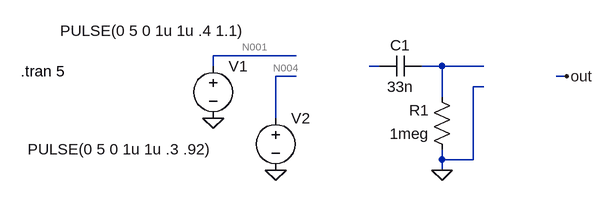
[diagram p0: schematic PseudoRandomPeriod.asc]
PseudoRandomPeriod.asc, the LTspice schematic file:
Version 4
SHEET 1 880 680
WIRE 160 144 32 144
WIRE 32 160 32 144
WIRE 288 160 272 160
WIRE 384 160 352 160
WIRE 448 160 384 160
WIRE 160 176 128 176
WIRE 576 176 560 176
WIRE 448 192 432 192
WIRE 384 208 384 160
WIRE 128 240 128 176
WIRE 384 304 384 288
WIRE 432 304 432 192
WIRE 432 304 384 304
WIRE 384 320 384 304
FLAG 32 240 0
FLAG 128 320 0
FLAG 384 320 0
FLAG 576 176 out
SYMBOL voltage 32 144 R0
WINDOW 3 -235 -38 Left 2
WINDOW 123 0 0 Left 2
WINDOW 39 0 0 Left 2
SYMATTR Value PULSE(0 5 0 1u 1u .4 1.1)
SYMATTR InstName V1
SYMBOL voltage 128 224 R0
WINDOW 3 -381 64 Left 2
WINDOW 123 0 0 Left 2
WINDOW 39 0 0 Left 2
SYMATTR Value PULSE(0 5 0 1u 1u .3 .92)
SYMATTR InstName V2
SYMBOL cap 352 144 R90
WINDOW 0 0 32 VBottom 2
WINDOW 3 32 32 VTop 2
SYMATTR InstName C1
SYMATTR Value 33n
SYMBOL res 400 304 R180
WINDOW 0 36 76 Left 2
WINDOW 3 36 40 Left 2
SYMATTR InstName R1
SYMATTR Value 1meg
TEXT -264 168 Left 2 !.tran 5

The netlist it stands for:
* PseudoRandomPeriod.asc
V1 N001 0 PULSE(0 5 0 1u 1u .4 1.1)
V2 N004 0 PULSE(0 5 0 1u 1u .3 .92)
C1 N003 N002 33n
R1 0 N003 1meg
.tran 5
.backanno
.end

* Results of the author's LTspice run, read from the files saved beside the schematic
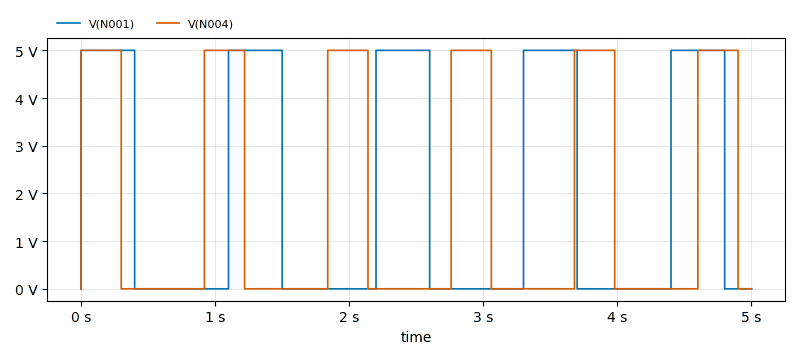
[diagram p1: Transient Analysis of PseudoRandomPeriod.asc, plotted from the saved traces]
* Transient Analysis, 1 run:
*   V(N001): min 0 V, max 5 V, average 2 V, rms 3.162 V, last 0 V
*   V(N004): min 0 V, max 5 V, average 1.8 V, rms 3 V, last 0 V